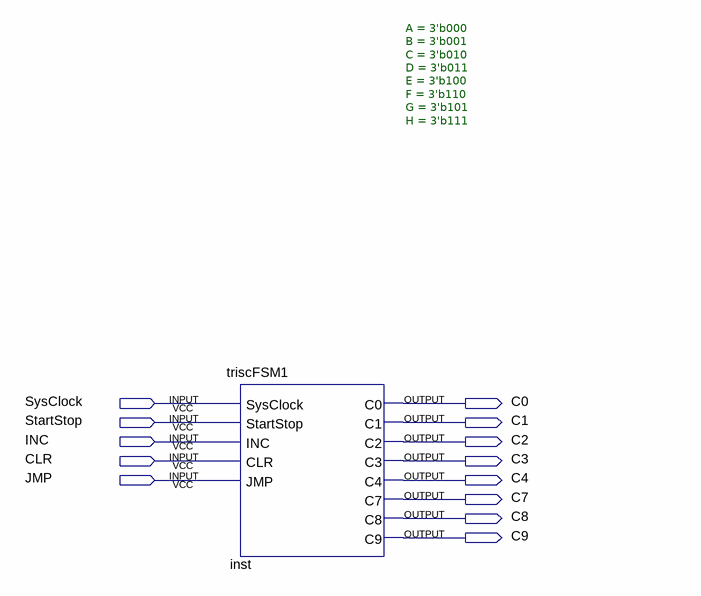
[diagram p0: schematic sheet]
// Quartus schematic HW8_4.bdf as structural Verilog: 1 symbols, 13 pins
module HW8_4 (
  input  SysClock,
  input  StartStop,
  input  INC,
  input  CLR,
  input  JMP,
  output C0,
  output C1,
  output C2,
  output C3,
  output C4,
  output C7,
  output C8,
  output C9
);

  triscFSM1 #(.A(3'b000), .B(3'b001), .C(3'b010), .D(3'b011), .E(3'b100), .F(3'b110), .G(3'b101), .H(3'b111)) inst (
    .SysClock(SysClock), .StartStop(StartStop), .INC(INC), .CLR(CLR), .JMP(JMP), .C0(C0), .C1(C1), .C2(C2),
    .C3(C3), .C4(C4), .C7(C7), .C8(C8), .C9(C9));
endmodule
